# Altium schematic sheet Charge.SchDoc
size A4
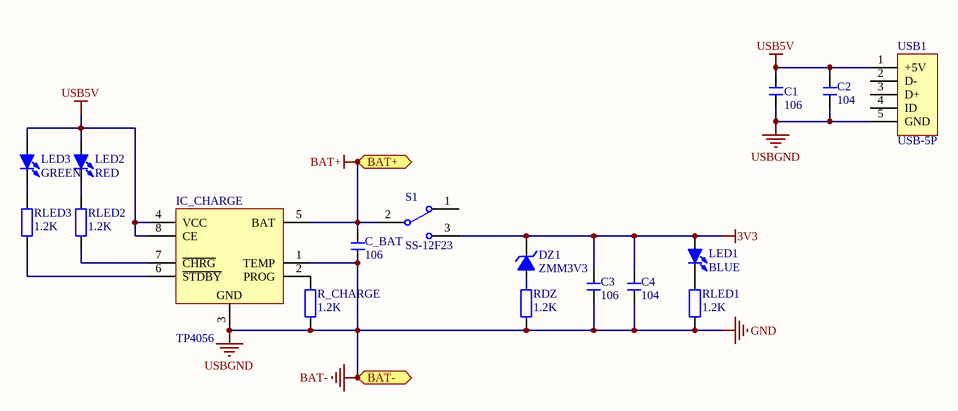
[diagram p0: Charge.SchDoc]

## Parts
C1  106  [C 0805_L]
C2  104  [C 0805_L]
C3  106  [C 0805_L]
C4  104  [C 0805_L]
C_BAT  106  [C 0805_L]
DZ1  ZMM3V3  [MINI_MELF (LL34)]
IC_CHARGE  TP4056  [SOP8_N]
LED1  BLUE  [LED 0805B]
LED2  RED  [LED 0805R]
LED3  GREEN  [LED 0805G]
R_CHARGE  1.2K  [R 0805_L]
RDZ  1.2K  [R 0805_L]
RLED1  1.2K  [R 0805_L]
RLED2  1.2K  [R 0805_L]
RLED3  1.2K  [R 0805_L]
S1  SS-12F23  [MSK-12C01-07]
USB1  USB-5P  [USB-MICRO_B]

## Ports
BAT+ (bidir), BAT- (bidir)

## Nets
3V3: C3.2 C4.2 DZ1.2(K) LED1.1(A) S1.3
BAT+: C_BAT.2 IC_CHARGE.5(BAT) S1.2 ; port BAT+
BAT-: C1.1 C2.1 C3.1 C4.1 C_BAT.1 IC_CHARGE.1(TEMP) IC_CHARGE.3(GND) R_CHARGE.1 RDZ.1 RLED1.1 USB1.5(GND) ; port BAT-  [also labelled GND, USBGND]
USB5V: C1.2 C2.2 IC_CHARGE.4(VCC) IC_CHARGE.8(CE) LED2.1(A) LED3.1(A) USB1.1(+5V)
NetDZ1_1: DZ1.1(A) RDZ.2
NetIC_CHARGE_2: IC_CHARGE.2(PROG) R_CHARGE.2
NetIC_CHARGE_6: IC_CHARGE.6(~{STDBY}) RLED3.1
NetIC_CHARGE_7: IC_CHARGE.7(~{CHRG}) RLED2.1
NetLED1_2: LED1.2(K) RLED1.2
NetLED2_2: LED2.2(K) RLED2.2
NetLED3_2: LED3.2(K) RLED3.2

Not connected (* = marked no-connect by the designer): S1 1; USB1 2(D-) 3(D+) 4(ID)

## Library data of the parts
C1-C4 C_BAT = C: 贴片电容; BOM名称: 无极性贴片电容; 淘宝ID: 封装库来自淘宝 ID：黄晶宝石; 联系售后，技术支持: https://shop463601444.taobao.com; 唯一出售店铺网址: https://shop463601444.taobao.com
DZ1 = 1N4619: 3V/0.5W稳压管; 版权归属: 封装库来自淘宝 ID：黄晶宝石; BOM名称: 3V/0.5W稳压管; 学习资源: www.ooocke.com
IC_CHARGE = TP4056: 锂电池充电管理; 淘宝ID: 封装库来自淘宝 ID：黄晶宝石; BOM名称: 锂电池充电管理; 技术支持，联系售后: https://shop463601444.taobao.com; 唯一出售店铺网址: https://shop463601444.taobao.com
LED1-LED3 = LED-SMD: 贴片LED; 版权归属: 封装库来自淘宝 ID：黄晶宝石; BOM名称: 贴片LED; 学习资源: https://shop463601444.taobao.com
R_CHARGE RDZ RLED1-RLED3 = R: 贴片电阻; 版权归属: 来自淘宝 ID：黄晶宝石; 封装库来自淘宝卖家 ID：黄晶宝石: 其他店铺购入均为盗版，不享受售后技术支持服务，请立即申请退款; BOM名称: 贴片电阻; 联系售后: https://shop463601444.taobao.com
S1 = SSW-1P: 1路波动开关; BOM名称: 波动开关; 版权归属: 封装库来自淘宝 ID：黄晶宝石; 学习资源: https://shop463601444.taobao.com
USB1 = USB-5P: 微型USB母座; BOM名称: 微型USB母座; 学习资源: https://shop463601444.taobao.com